# Altium schematic sheet PROC106B_AOP_IO.SchDoc: AOP_IO
size 431 x 279 mm; Date: Not shown in title block; ApprovedBy: Not shown in title block; CheckedBy: Not shown in title block; Author: Not shown in title block; CompanyName: Not shown in title block; DrawnBy: Antony/Anand Ram; Engineer: Not shown in title block; Organization: Not shown in title block; Address1: Not shown in title block; Address2: Not shown in title block; Address3: Not shown in title block; Address4: Not shown in title block; DocumentNumber: 3; Revision: Use project parameter SCH_Rev; SheetNumber: 3; SheetTotal: 12; PageSetup: Record=PageOptions|CenterHorizontal=True|CenterVertical=True|PrintScale=1.00|XCorrection=1.00|YCorrection=1.00|PrintKind=0|BorderSize=5000000|LeftOffset=0|BottomOffset=0|Orientation=2|PaperLength=1000|PaperWidth=1000|Scale=100|PaperSource=15|PrintQuality=600|MediaType=1|DitherType=10|PaperKind=Letter|PrintScaleMode=1; CurrentTime: Not shown in title block; CurrentDate: Not shown in title block; Time: Not shown in title block; DocumentFullPathAndName: Not shown in title block; DocumentName: Not shown in title block; ModifiedDate: Not shown in title block; ImagePath: Not shown in title block
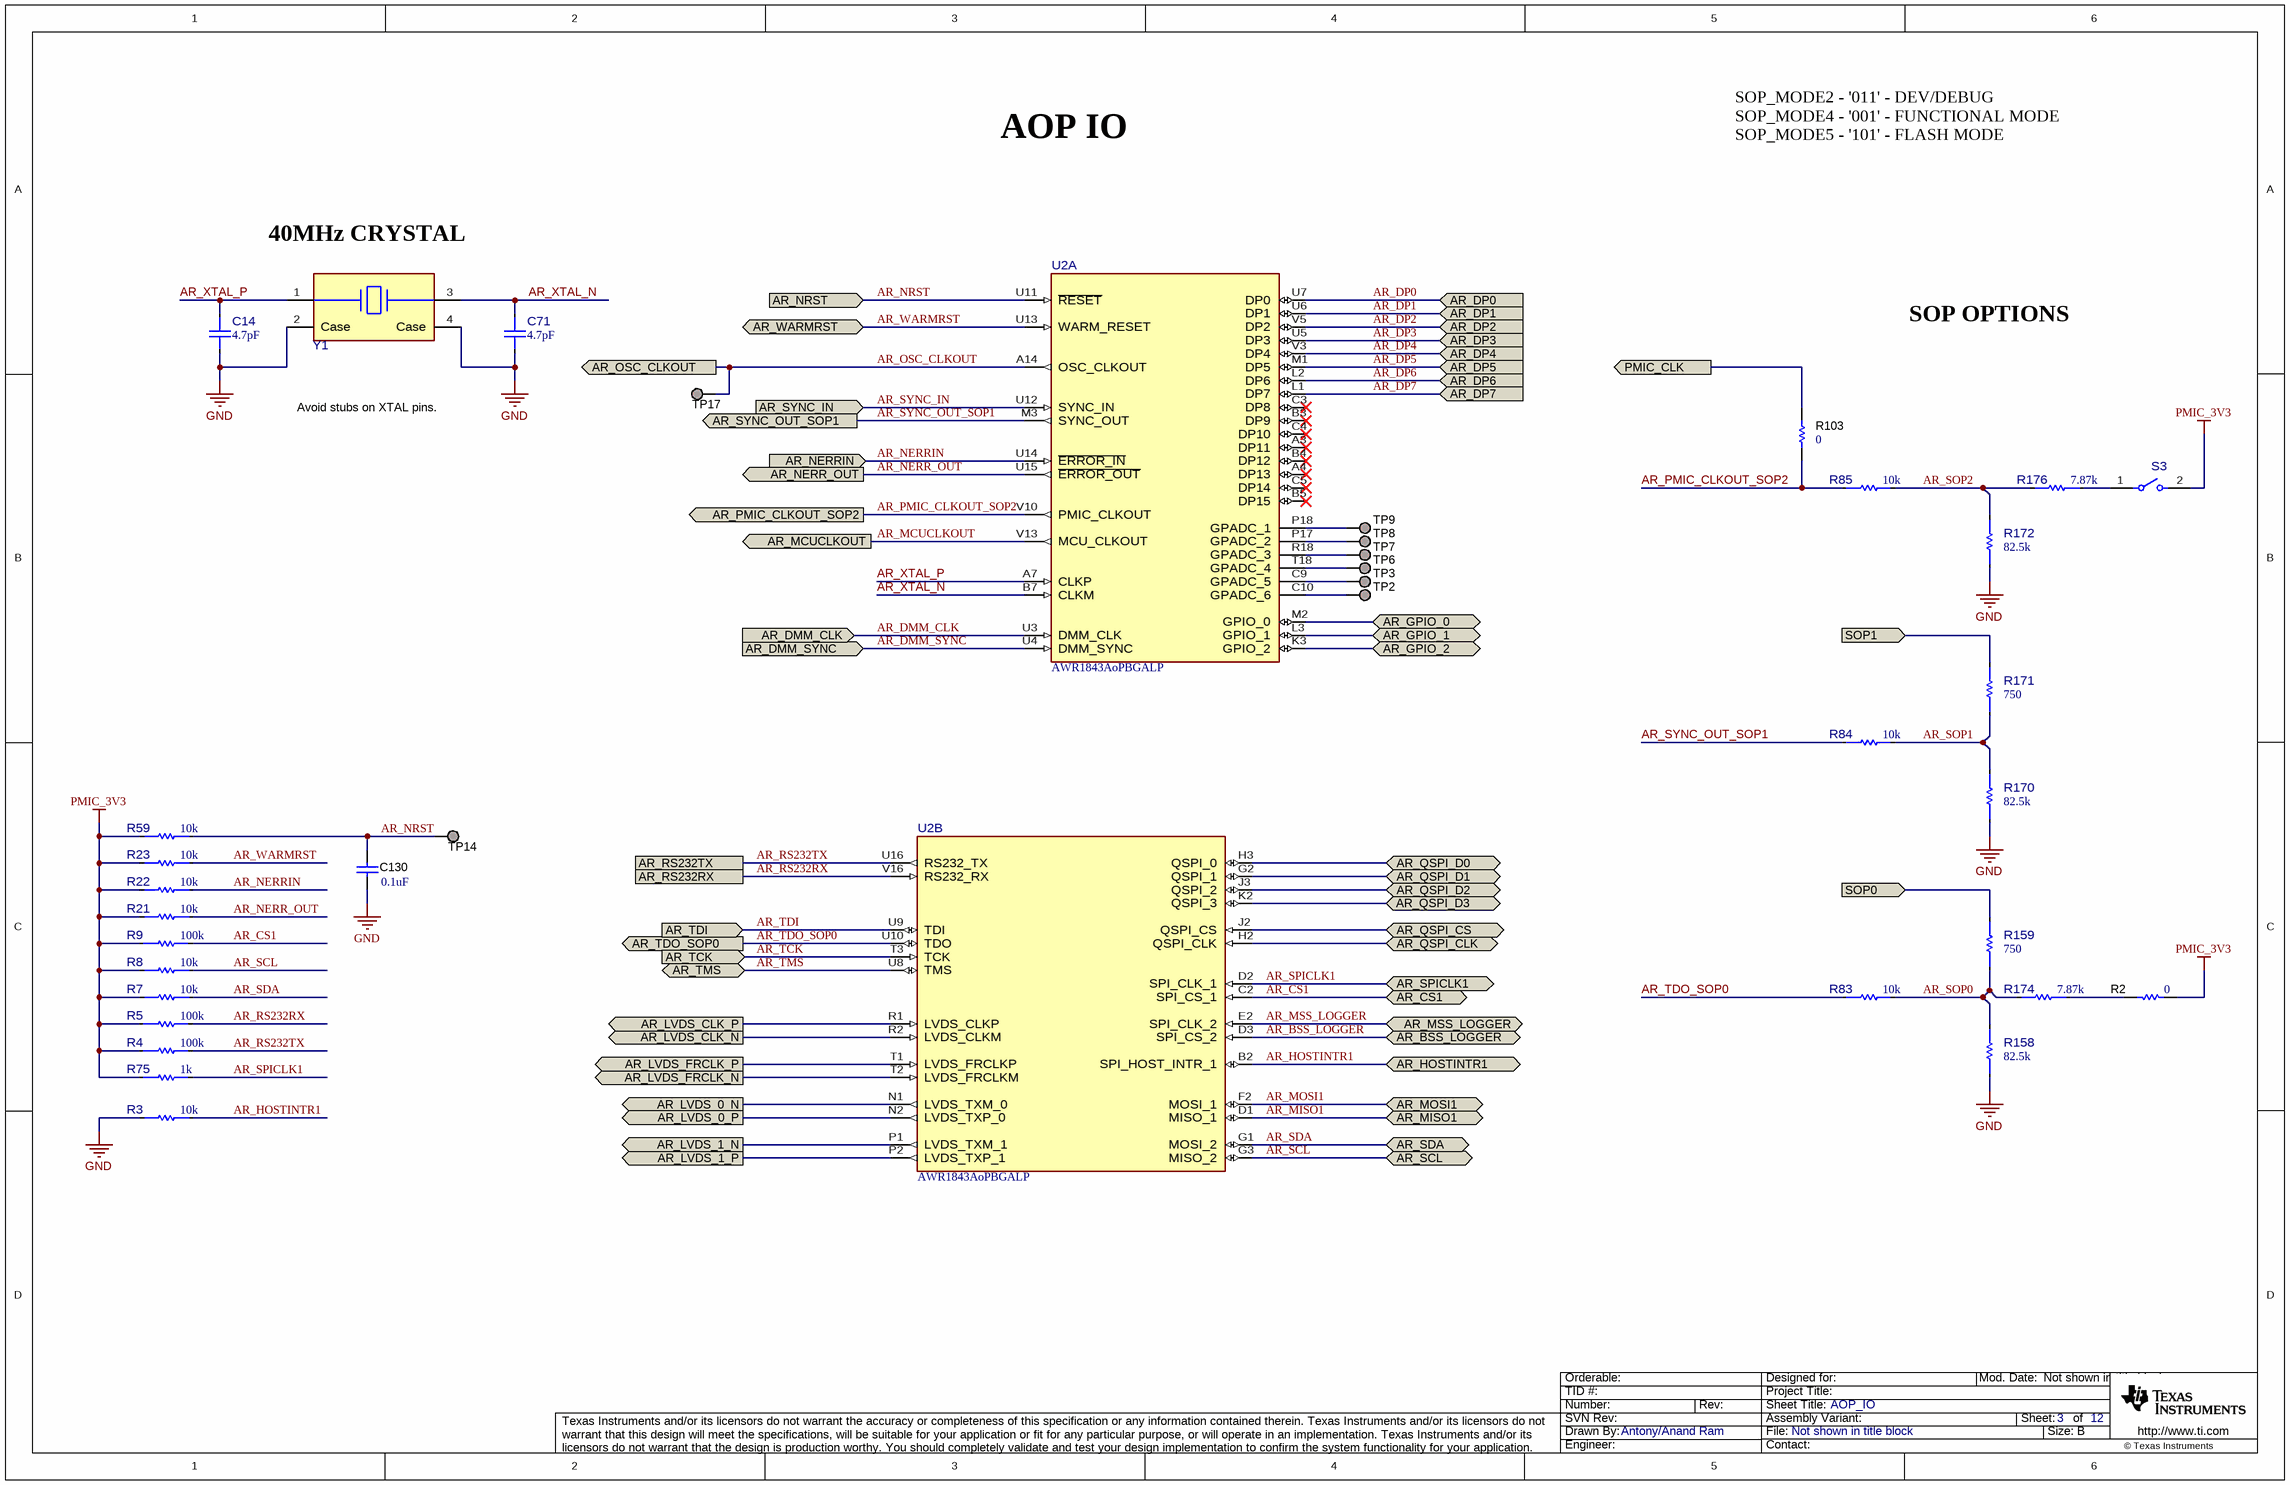
[diagram p0: PROC106B_AOP_IO.SchDoc]

## Parts
C14  ValueDisplayed: 4.7pF  [FP-CGA1A2C0G1H4R7C030BA_0201-IPC_C]  (hidden comment: CGA1A2C0G1H4R7C030BA)
C71  ValueDisplayed: 4.7pF  [FP-CGA1A2C0G1H4R7C030BA_0201-IPC_C]  (hidden comment: CGA1A2C0G1H4R7C030BA)
C130  ValueDisplayed: 0.1uF  [0402L]  (hidden comment: GCM155R71C104KA55D)
R2  ValueDisplayed: 0  [0201L]  (hidden comment: ERJ-1GN0R00C)
R3  value 10k  [FP-ERA-1AEB103C_0201-IPC_C]  (hidden comment: ERA-1AEB103C)
R4  value 100k  [FP-ERJ-1GNF1003C_0201-IPC_C]  (hidden comment: ERJ-1GNF1003C)
R5  value 100k  [FP-ERJ-1GNF1003C_0201-IPC_C]  (hidden comment: ERJ-1GNF1003C)
R7  value 10k  [FP-ERA-1AEB103C_0201-IPC_C]  (hidden comment: ERA-1AEB103C)
R8  value 10k  [FP-ERA-1AEB103C_0201-IPC_C]  (hidden comment: ERA-1AEB103C)
R9  value 100k  [FP-ERJ-1GNF1003C_0201-IPC_C]  (hidden comment: ERJ-1GNF1003C)
R21  value 10k  [FP-ERA-1AEB103C_0201-IPC_C]  (hidden comment: ERA-1AEB103C)
R22  value 10k  [FP-ERA-1AEB103C_0201-IPC_C]  (hidden comment: ERA-1AEB103C)
R23  value 10k  [FP-ERA-1AEB103C_0201-IPC_C]  (hidden comment: ERA-1AEB103C)
R59  value 10k  [FP-ERA-1AEB103C_0201-IPC_C]  (hidden comment: ERA-1AEB103C)
R75  value 1k  [FP-ERJ-1GNJ102C_0201-IPC_C]  (hidden comment: ERJ-1GNJ102C)
R83  value 10k  [FP-ERA-1AEB103C_0201-IPC_C]  (hidden comment: ERA-1AEB103C)
R84  value 10k  [FP-ERA-1AEB103C_0201-IPC_C]  (hidden comment: ERA-1AEB103C)
R85  value 10k  [FP-ERA-1AEB103C_0201-IPC_C]  (hidden comment: ERA-1AEB103C)
R103  ValueDisplayed: 0  [0201L]  (hidden comment: ERJ-1GN0R00C)
R158  value 82.5k  [FP-ERJ-1GNF8252C_0201-IPC_C]  (hidden comment: ERJ-1GNF8252C)
R159  value 750  [FP-ERJ-1GNJ751C_0201-IPC_C]  (hidden comment: ERJ-1GNJ751C)
R170  value 82.5k  [FP-ERJ-1GNF8252C_0201-IPC_C]  (hidden comment: ERJ-1GNF8252C)
R171  value 750  [FP-ERJ-1GNJ751C_0201-IPC_C]  (hidden comment: ERJ-1GNJ751C)
R172  value 82.5k  [FP-ERJ-1GNF8252C_0201-IPC_C]  (hidden comment: ERJ-1GNF8252C)
R174  value 7.87k  [FP-ERJ-1GNF7871C_0201-IPC_C]  (hidden comment: ERJ-1GNF7871C)
R176  value 7.87k  [FP-ERJ-1GNF7871C_0201-IPC_C]  (hidden comment: ERJ-1GNF7871C)
S3  CHS-01TA  [FP-CHS-01TA_SMT_SW_5MM4_2MM5-MFG]  (value not drawn)
TP2  TESTPOINT  [TP_25MIL-SMT]  (value not drawn)  (no BOM)
TP3  TESTPOINT  [TP_25MIL-SMT]  (value not drawn)  (no BOM)
TP6  TESTPOINT  [TP_25MIL-SMT]  (value not drawn)  (no BOM)
TP7  TESTPOINT  [TP_25MIL-SMT]  (value not drawn)  (no BOM)
TP8  TESTPOINT  [TP_25MIL-SMT]  (value not drawn)  (no BOM)
TP9  TESTPOINT  [TP_25MIL-SMT]  (value not drawn)  (no BOM)
TP14  TESTPOINT  [TP_25MIL-SMT]  (value not drawn)  (no BOM)
TP17  TESTPOINT  [TP_25MIL-SMT]  (value not drawn)  (no BOM)
U2  AWR1843AoPBGALP  [ALP0180A-MFG]  (parts A,B of 5)
Y1  FW4000044Q  [FP-FW4000044Q_4-SMD-2.0x1.6mm-MFG]  (value not drawn)

## Ports
AR_BSS_LOGGER (bidir), AR_CS1 (bidir), AR_DMM_CLK (in), AR_DMM_SYNC (in), AR_DP0 (in), AR_DP1 (in), AR_DP2 (in), AR_DP3 (in), AR_DP4 (in), AR_DP5 (in), AR_DP6 (in), AR_DP7 (in), AR_GPIO_0 (bidir), AR_GPIO_1 (bidir), AR_GPIO_2 (bidir), AR_HOSTINTR1 (bidir), AR_LVDS_0_N (out), AR_LVDS_0_P (out), AR_LVDS_1_N (out), AR_LVDS_1_P (out), AR_LVDS_CLK_N (out), AR_LVDS_CLK_P (out), AR_LVDS_FRCLK_N (out), AR_LVDS_FRCLK_P (out), AR_MCUCLKOUT (out), AR_MISO1 (bidir), AR_MOSI1 (bidir), AR_MSS_LOGGER (bidir), AR_NERR_OUT (out), AR_NERRIN (in), AR_NRST (in), AR_OSC_CLKOUT (out), AR_PMIC_CLKOUT_SOP2 (out), AR_QSPI_CLK (bidir), AR_QSPI_CS (bidir), AR_QSPI_D0 (bidir), AR_QSPI_D1 (bidir), AR_QSPI_D2 (bidir), AR_QSPI_D3 (bidir), AR_RS232RX, AR_RS232TX, AR_SCL (bidir), AR_SDA (bidir), AR_SPICLK1 (bidir), AR_SYNC_IN (in), AR_SYNC_OUT_SOP1 (out), AR_TCK (in), AR_TDI (in), AR_TDO_SOP0 (out), AR_TMS (bidir), AR_WARMRST (bidir), PMIC_CLK (out), SOP0 (in), SOP1 (in)

## Nets
GND: C14.2 C71.2 C130.1 R3.2 R158.1 R170.1 R172.1 Y1.2(Case) Y1.4(Case)
PMIC_3V3: R2.2 R4.1 R5.1 R7.2 R8.2 R9.1 R21.2 R22.2 R23.2 R59.2 R75.1 S3.2
AR_BSS_LOGGER: U2.D3(SPI_CS_2) ; port AR_BSS_LOGGER
AR_CS1: R9.2 U2.C2(SPI_CS_1) ; port AR_CS1
AR_DMM_CLK: U2.U3(DMM_CLK) ; port AR_DMM_CLK
AR_DMM_SYNC: U2.U4(DMM_SYNC) ; port AR_DMM_SYNC
AR_DP0: U2.U7(DP0) ; port AR_DP0
AR_DP1: U2.U6(DP1) ; port AR_DP1
AR_DP2: U2.V5(DP2) ; port AR_DP2
AR_DP3: U2.U5(DP3) ; port AR_DP3
AR_DP4: U2.V3(DP4) ; port AR_DP4
AR_DP5: U2.M1(DP5) ; port AR_DP5
AR_DP6: U2.L2(DP6) ; port AR_DP6
AR_DP7: U2.L1(DP7) ; port AR_DP7
AR_GPIO_0: U2.M2(GPIO_0) ; port AR_GPIO_0
AR_GPIO_1: U2.L3(GPIO_1) ; port AR_GPIO_1
AR_GPIO_2: U2.K3(GPIO_2) ; port AR_GPIO_2
AR_HOSTINTR1: R3.1 U2.B2(SPI_HOST_INTR_1) ; port AR_HOSTINTR1
AR_LVDS_0_N: U2.N1(LVDS_TXM_0) ; port AR_LVDS_0_N
AR_LVDS_0_P: U2.N2(LVDS_TXP_0) ; port AR_LVDS_0_P
AR_LVDS_1_N: U2.P1(LVDS_TXM_1) ; port AR_LVDS_1_N
AR_LVDS_1_P: U2.P2(LVDS_TXP_1) ; port AR_LVDS_1_P
AR_LVDS_CLK_N: U2.R2(LVDS_CLKM) ; port AR_LVDS_CLK_N
AR_LVDS_CLK_P: U2.R1(LVDS_CLKP) ; port AR_LVDS_CLK_P
AR_LVDS_FRCLK_N: U2.T2(LVDS_FRCLKM) ; port AR_LVDS_FRCLK_N
AR_LVDS_FRCLK_P: U2.T1(LVDS_FRCLKP) ; port AR_LVDS_FRCLK_P
AR_MCUCLKOUT: U2.V13(MCU_CLKOUT) ; port AR_MCUCLKOUT
AR_MISO1: U2.D1(MISO_1) ; port AR_MISO1
AR_MOSI1: U2.F2(MOSI_1) ; port AR_MOSI1
AR_MSS_LOGGER: U2.E2(SPI_CLK_2) ; port AR_MSS_LOGGER
AR_NERR_OUT: R21.1 U2.U15(~{ERROR_OUT}) ; port AR_NERR_OUT
AR_NERRIN: R22.1 U2.U14(~{ERROR_IN}) ; port AR_NERRIN
AR_NRST: C130.2 R59.1 TP14.1 U2.U11(~{RESET}) ; port AR_NRST
AR_OSC_CLKOUT: TP17.1 U2.A14(OSC_CLKOUT) ; port AR_OSC_CLKOUT
AR_PMIC_CLKOUT_SOP2: R85.1 R103.1 U2.V10(PMIC_CLKOUT) ; port AR_PMIC_CLKOUT_SOP2
AR_QSPI_CLK: U2.H2(QSPI_CLK) ; port AR_QSPI_CLK
AR_QSPI_CS: U2.J2(QSPI_CS) ; port AR_QSPI_CS
AR_QSPI_D0: U2.H3(QSPI_0) ; port AR_QSPI_D0
AR_QSPI_D1: U2.G2(QSPI_1) ; port AR_QSPI_D1
AR_QSPI_D2: U2.J3(QSPI_2) ; port AR_QSPI_D2
AR_QSPI_D3: U2.K2(QSPI_3) ; port AR_QSPI_D3
AR_RS232RX: R5.2 U2.V16(RS232_RX) ; port AR_RS232RX
AR_RS232TX: R4.2 U2.U16(RS232_TX) ; port AR_RS232TX
AR_SCL: R8.1 U2.G3(MISO_2) ; port AR_SCL
AR_SDA: R7.1 U2.G1(MOSI_2) ; port AR_SDA
AR_SOP0: R83.2 R158.2 R159.1 R174.2
AR_SOP1: R84.2 R170.2 R171.1
AR_SOP2: R85.2 R172.2 R176.2
AR_SPICLK1: R75.2 U2.D2(SPI_CLK_1) ; port AR_SPICLK1
AR_SYNC_IN: U2.U12(SYNC_IN) ; port AR_SYNC_IN
AR_SYNC_OUT_SOP1: R84.1 U2.M3(SYNC_OUT) ; port AR_SYNC_OUT_SOP1
AR_TCK: U2.T3(TCK) ; port AR_TCK
AR_TDI: U2.U9(TDI) ; port AR_TDI
AR_TDO_SOP0: R83.1 U2.U10(TDO) ; port AR_TDO_SOP0
AR_TMS: U2.U8(TMS) ; port AR_TMS
AR_WARMRST: R23.1 U2.U13(WARM_RESET) ; port AR_WARMRST
AR_XTAL_N: C71.1 U2.B7(CLKM) Y1.3(2_Xtal)
AR_XTAL_P: C14.1 U2.A7(CLKP) Y1.1(1_Xtal)
PMIC_CLK: R103.2 ; port PMIC_CLK
SOP0: R159.2 ; port SOP0
SOP1: R171.2 ; port SOP1
NetR2_1: R2.1 R174.1
NetR176_1: R176.1 S3.1
NetTP2_1: TP2.1 U2.C10(GPADC_6)
NetTP3_1: TP3.1 U2.C9(GPADC_5)
NetTP6_1: TP6.1 U2.T18(GPADC_4)
NetTP7_1: TP7.1 U2.R18(GPADC_3)
NetTP8_1: TP8.1 U2.P17(GPADC_2)
NetTP9_1: TP9.1 U2.P18(GPADC_1)

Not connected (* = marked no-connect by the designer): U2 A3(DP11)* A4(DP13)* B3(DP9)* B4(DP12)* B5(DP15)* C3(DP8)* C4(DP10)* C5(DP14)*

## Notes on the sheet
- AOP IO
- SOP_MODE2 - '011' - DEV/DEBUG
  SOP_MODE4 - '001' - FUNCTIONAL MODE
  SOP_MODE5 - '101' - FLASH MODE
- 40MHz CRYSTAL
- SOP OPTIONS
- Avoid stubs on XTAL pins.
- Drawn By:
- SVN Rev:
- Number:
- TID #:
- Orderable:
- Rev:
- Sheet Title:
- File:
- Project Title:
- Designed for:
- Assembly Variant:
- Mod. Date:
- Sheet:
- Size:
- of
- B
- http://www.ti.com
- Texas Instruments and/or its licensors do not warrant the accuracy or completeness of this specification or any information contained therein. Texas Instruments and/or its licensors do not warrant that this design will meet the specifications, will be suitable for your application or fit for any particular purpose, or will operate in an implementation. Texas Instruments and/or its licensors do not warrant that the design is production worthy. You should completely validate and test your design implementation to confirm the system functionality for your application.
- Engineer:
- Contact:
- © Texas Instruments

## Library data of the parts
C14 C71 = CMP-0090493-1: Cap Ceramic 4.7pF 50V C0G 0.25pF Pad SMD 0201 125°C Automotive T/R; Manufacturer: TDK; AEC Grade: Grade 1; AEC Qualified: Yes; SizeZ_mm: 0.4mm; TempCo: 30ppm/°C; RoHS: TRUE; Value: 4.7pF; Cap_F: 4.7pF; ComponentLink1Description: Datasheet; ComponentLink1URL: https://product.tdk.com/info/en/catalog/spec/mlccspec_automotive_general_en.pdf; PackageReference: 0201; PartNumber: CGA1A2C0G1H4R7C030BA; VDC_V: 50V; datasheet: https://product.tdk.com/info/en/catalog/spec/mlccspec_automotive_general_en.pdf; Datasheet Path: datasheets/Cap-CGA1A2C0G1H4R7C030BA.pdf; helpURL: https://upverter.com/upn/revision/6d92b1250c1f5160/; Lead Free: Yes; Operating Temperature Range: -55°C to +125°C; Part Number: CGA1A2C0G1H4R7C030BA; Temperature Characteristic: C0G
C130 = CMP-0006351-2: CAP, CERM, 0.1 uF, 16 V, +/- 10%, X7R, 0402; Manufacturer: MuRata; Cap_F: 100nF; SizeZ_mm: 0.6; VDC_V: 16V; AEC Category: Q200; Cap_Case: 0402; Polarized: N; SizeArea_mm2: 0.5; SizeAreaWB_mm2: 3; SizeX_mm: 1; TaMax_C: 125°C; TaMin_C: -55°C; U/M: EA; Value1: Unknown; Value: 0.1uF; RoHS: Y; AEC Qualified: ?; ComponentLink1Description: Datasheet link; ComponentLink1URL: http://psearch.murata.com/capacitor/product/GCM155R71C104KA55%23.pdf; PackageReference: 0402; PartNumber: GCM155R71C104KA55D; TempCo: X7R; Tolerance_%: 10%; CompType: Capacitor; MountType: SMT; SizeY_mm: 0.5; Supplier 1: Digi-Key; Supplier Part Number 1: 490-4759-2-ND; Technology: Ceramic; Value2: 16V; LatestRevisionDate: 2017-03-09; Published: 2008-06-19; Publisher: Texas Instruments
R2 R103 = CMP-0065361-1: RES, 0, 5%, .05 W, AEC-Q200 Grade 0, 0201; Manufacturer: Panasonic; AEC Qualified: Y; Power_W: 50mW; SizeZ_mm: 0.26; TempCo: ppm/C; AEC Category: Q200; EIA_Code: E24; Green_Lifecycle: Not Set; Green_REACh: Incomplete; SizeArea_mm2: 0.18; SizeX_mm: 0.6; SizeY_mm: 0.3; U/M: EA; Value2: .05W; Value: 0; Value_Code: 0000; RoHS: Y; ComponentLink1Description: Datasheet link; ComponentLink1URL: https://industrial.panasonic.com/cdbs/www-data/pdf/RDA0000/AOA0000C281.pdf; PackageReference: 0201; PartNumber: ERJ-1GN0R00C; Res_ohm: 0; Technology: Thick Film; Tolerance_%: 5%; AEC Grade: 0; CompType: Resistor; Green_EU RoHS-2: Incomplete; Green_EU RoHS: Incomplete; LatestRevisionDate: 2017-06-05; MountType: SMT; Published: 2016-10-14; Publisher: Texas Instruments; Supplier 1: Digi-Key; Supplier 2: Newark; Supplier 3: Mouser; Supplier Part Number 1: P15979CT-ND; Supplier Part Number 2: 51W5934; Supplier Part Number 3: 667-ERJ-1GN0R00C; Value1: 5%
R3 R7 R8 R21-R23 R59 R83-R85 = CMP-0090084-1: RES SMD 10K OHM 0.1% 1/20W 0201; Manufacturer: Panasonic; AEC Qualified: No; Power_W: 50mW; SizeZ_mm: 0.26mm; TempCo: 25ppm/°C; VDC_V: 25V; RoHS: TRUE; ComponentLink1Description: Datasheet; ComponentLink1URL: https://industrial.panasonic.com/cdbs/www-data/pdf/RDM0000/AOA0000C307.pdf; PackageReference: 0201; PartNumber: ERA-1AEB103C; Res_ohm: 10k; Technology: Thin Film; Tolerance_%: 0.1%; datasheet: https://industrial.panasonic.com/cdbs/www-data/pdf/RDM0000/AOA0000C307.pdf; Datasheet Path: datasheets/Res-ERA-1AEB103C.pdf; Digikey Description: RES SMD 10K OHM 0.1% 1/20W 0201; Digikey Part Number: P10KBXCT-ND; helpURL: https://upverter.com/upn/revision/ad75fa42d92ba837/; Lead Free: Yes; Mouser Part Number: 667-ERA-1AEB103C; Operating Temperature Range: -55°C to +155°C; Part Number: ERA-1AEB103C; Series: ERA; Supplier 1: Digikey; Supplier 2: Mouser; Supplier Part Number 1: P10KBXCT-ND; Supplier Part Number 2: 667-ERA-1AEB103C
R4 R5 R9 = CMP-0090298-1: 100 kOhms ±1% 0.05W, 1/20W Chip Resistor 0201 (0603 Metric) Automotive AEC-Q200 Thick Film; Manufacturer: Panasonic Electronic Components; AEC Grade: Grade 1; AEC Qualified: Yes; Power_W: 50mW; SizeZ_mm: 0.26mm; TempCo: 200ppm/°C; VDC_V: 25V; RoHS: TRUE; ComponentLink1Description: Datasheet; ComponentLink1URL: https://industrial.panasonic.com/cdbs/www-data/pdf/RDA0000/AOA0000C304.pdf; PackageReference: 0201; PartNumber: ERJ-1GNF1003C; Res_ohm: 100k; Supplier 1: Digikey; Supplier 2: Mouser; Supplier Part Number 1: P122655CT-ND; Supplier Part Number 2: 667-ERJ-1GNF1003C; Technology: Thick Film; Tolerance_%: 1%; datasheet: https://industrial.panasonic.com/cdbs/www-data/pdf/RDA0000/AOA0000C304.pdf; Datasheet Path: datasheets/Res-ERJ-1GNF1003C.pdf; Digikey Description: RES SMD 100K OHM 1% 1/20W 0201; Digikey Part Number: P122655CT-ND; helpURL: https://upverter.com/upn/revision/52b354a5d57be433/; Lead Free: Yes; Mouser Description: Thick Film Resistors 0201 100Kohm 1% HalogenFree AEC-Q200; Mouser Part Number: 667-ERJ-1GNF1003C; Operating Temperature Range: -55°C to +125°C; Part Number: ERJ-1GNF1003C; Series: ERJ
R75 = CMP-0090500-1: 1 kOhms ±5% 0.05W, 1/20W Chip Resistor 0201 (0603 Metric) Automotive AEC-Q200 Thick Film; Manufacturer: Panasonic Electronic Components; AEC Grade: Grade 1; AEC Qualified: Yes; Power_W: 50mW; SizeZ_mm: 0.26mm; TempCo: 200ppm/°C; VDC_V: 25V; RoHS: TRUE; ComponentLink1Description: Datasheet; ComponentLink1URL: http://industrial.panasonic.com/www-cgi/jvcr13pz.cgi?E+PZ+3+AOA0002+ERJ1GNJ102C+7+WW; PackageReference: 0201; PartNumber: ERJ-1GNJ102C; Res_ohm: 1k; Supplier 1: Digikey; Supplier 2: Mouser; Supplier Part Number 1: P123221CT-ND; Supplier Part Number 2: 667-ERJ-1GNJ102C; Technology: Thick Film; Tolerance_%: 5%; datasheet: http://industrial.panasonic.com/www-cgi/jvcr13pz.cgi?E+PZ+3+AOA0002+ERJ1GNJ102C+7+WW; Datasheet Path: datasheets/Res-ERJ-1GNJ102C.pdf; Digikey Description: RES SMD 1K OHM 5% 1/20W 0201; Digikey Part Number: P123221CT-ND; helpURL: https://upverter.com/upn/revision/53a311929d77a537/; Lead Free: Yes; Mouser Description: Thick Film Resistors - SMD 0201 1Kohm 5% HalogenFree AEC-Q200; Mouser Part Number: 667-ERJ-1GNJ102C; Operating Temperature Range: -55°C to +125°C; Part Number: ERJ-1GNJ102C; Series: ERJ
R158 R170 R172 = CMP-0090499-1: Res Thick Film 0201 82.5K Ohm 1% 1/20W ±200ppm/°C Molded SMD SMD T/R; Manufacturer: Panasonic; AEC Grade: Grade 1; AEC Qualified: Yes; Power_W: 50mW; SizeZ_mm: 0.26mm; VDC_V: 25V; RoHS: TRUE; ComponentLink1Description: Datasheet; ComponentLink1URL: https://industrial.panasonic.com/cdbs/www-data/pdf/RDA0000/AOA0000C304.pdf; PackageReference: 0201; PartNumber: ERJ-1GNF8252C; Res_ohm: 82.5k; Supplier 1: Digikey; Supplier 2: Mouser; Supplier Part Number 1: P123175CT-ND; Supplier Part Number 2: 667-ERJ-1GNF8252C; Technology: Thick Film; TempCo: 200ppm/°C; Tolerance_%: 1%; datasheet: https://industrial.panasonic.com/cdbs/www-data/pdf/RDA0000/AOA0000C304.pdf; Datasheet Path: datasheets/Res-ERJ-1GNF8252C.pdf; Digikey Description: RES SMD 82.5K OHM 1% 1/20W 0201; Digikey Part Number: P123175CT-ND; helpURL: https://upverter.com/upn/revision/4f118edabd8df0f2/; Lead Free: Yes; Mouser Description: Res Thick Film 0201 82.5K Ohm 1% 1/20W ±200ppm/°C Molded SMD SMD T/R; Mouser Part Number: 667-ERJ-1GNF8252C; Operating Temperature Range: -55°C to +125°C; Part Number: ERJ-1GNF8252C; Series: ERJ
R159 R171 = CMP-0090503-1: Res Thick Film 0201 750 Ohm 5% 0.05W(1/20W) ±200ppm/C Pad SMD Automotive T/R; Manufacturer: Panasonic Electronic Components; AEC Grade: Grade 1; AEC Qualified: Yes; Power_W: 50mW; SizeZ_mm: 0.26mm; TempCo: 200ppm/°C; VDC_V: 25V; RoHS: TRUE; ComponentLink1Description: Datasheet; ComponentLink1URL: https://industrial.panasonic.com/cdbs/www-data/pdf/RDA0000/AOA0000C301.pdf; PackageReference: 0201; PartNumber: ERJ-1GNJ751C; Res_ohm: 750; Supplier 1: Digikey; Supplier 2: Mouser; Supplier Part Number 1: P123367CT-ND; Supplier Part Number 2: 667-ERJ-1GNJ751C; Technology: Thick Film; Tolerance_%: 5%; datasheet: https://industrial.panasonic.com/cdbs/www-data/pdf/RDA0000/AOA0000C301.pdf; Datasheet Path: datasheets/Res-ERJ-1GNJ751C.pdf; Digikey Description: RES SMD 750 OHM 5% 1/20W 0201; Digikey Part Number: P123367CT-ND; helpURL: https://upverter.com/upn/revision/8f71e8ce5b6d0ac2/; Lead Free: Yes; Mouser Description: Thick Film Resistors - SMD 0201 750ohm 5% HalogenFree AEC-Q200; Mouser Part Number: 667-ERJ-1GNJ751C; Operating Temperature Range: -55°C to +125°C; Part Number: ERJ-1GNJ751C; Series: ERJ
R174 R176 = CMP-0090498-1: Res Thick Film 0201 7.87K Ohm 1% 1/20W ±200ppm/°C Molded SMD SMD T/R; Manufacturer: Panasonic; AEC Grade: Grade 1; AEC Qualified: Yes; Power_W: 50mW; SizeZ_mm: 0.26mm; VDC_V: 25V; RoHS: TRUE; ComponentLink1Description: Datasheet; ComponentLink1URL: https://industrial.panasonic.com/cdbs/www-data/pdf/RDA0000/AOA0000C304.pdf; PackageReference: 0201; PartNumber: ERJ-1GNF7871C; Res_ohm: 7.87k; Supplier 1: Digikey; Supplier 2: Mouser; Supplier Part Number 1: P123160CT-ND; Supplier Part Number 2: 667-ERJ-1GNF7871C; Technology: Thick Film; TempCo: 200ppm/°C; Tolerance_%: 1%; datasheet: https://industrial.panasonic.com/cdbs/www-data/pdf/RDA0000/AOA0000C304.pdf; Datasheet Path: datasheets/Res-ERJ-1GNF7871C.pdf; Digikey Description: RES SMD 7.87K OHM 1% 1/20W 0201; Digikey Part Number: P123160CT-ND; helpURL: https://upverter.com/upn/revision/e5a66236bcc50cef/; Lead Free: Yes; Mouser Description: Thick Film Resistors - SMD 0201 7.87Kohm 1% HalogenFree AEC-Q200; Mouser Part Number: 667-ERJ-1GNF7871C; Operating Temperature Range: -55°C to +125°C; Part Number: ERJ-1GNF7871C; Series: ERJ
S3 = CMP-0087181-1: SWITCH SLIDE DIP SPST 100MA 6V; Manufacturer: Nidec Copal Electronics; PositionCount: 1; SizeZ_mm: 2.5mm; Symbol Name: SYM-CHS-01TA; RoHS: TRUE; Circuit: SPST; ComponentLink1Description: Datasheet; ComponentLink1URL: https://www.nidec-copal-electronics.com/e/catalog/switch/chs.pdf; MountType: Surface Mount; PackageReference: SMT_SW_5MM4_2MM5; PartNumber: CHS-01TA; VDC_V: 6V
TP2 TP3 TP6-TP9 TP14 TP17 = CMP-0078143-3: TEST POINT.  No entry in BOM.; CompType: Testpoint; Manufacturer: N/A; PackageReference: N/A; PartNumber: N/A; Library Reference: TESTPOINT
U2 = CMP-0090288-2: Manufacturer: Texas Instruments; Standoff Height: 0.31mm; SizeZ_mm: 0.965mm; AEC Category: Q200; CompType: IC; PackageReference: FCBGA180; helpURL: https://upverter.com/upn/revision/1d9228af6d9453a7/; RoHS: UNKNOWN; Datasheet Path: datasheets/IC-AWR1843AoPBGALP.pdf; Operating Temperature Range: to; PartNumber: AWR1843AoPBGALP; Part Number: AWR1843AoPBGALP; ComponentLink2URL: http://www.ti.com/product/GPN; ComponentLink3URL: http://www.ti.com/product/GPN/datasheet; ComponentLink1URL: http://www.ti.com/lit/ds/symlink/GPN.pdf; ComponentLink3Description: Online Datasheet; ComponentLink2Description: Product Folder; ComponentLink1Description: Datasheet Link
Y1 = CMP-0090505-1: 40MHz ±10ppm Crystal 8pF 50 Ohms 4-SMD, No Lead; Manufacturer: Diodes; AEC Qualified: Yes; Frequency Stability: 50ppm; SizeZ_mm: 0.55mm; AEC Grade: Grade 1; Esr: 50; RoHS: TRUE; ComponentLink1Description: Datasheet; ComponentLink1URL: https://www.diodes.com/assets/Datasheets/FW.pdf; Frequency_Fixed: 40MHz; Frequency Tolerance: 10ppm; Load Capacitance: 8pF; PackageReference: 4-SMD-2.0x1.6mm; PartNumber: FW4000044Q; datasheet: https://www.diodes.com/assets/Datasheets/FW.pdf; Datasheet Path: datasheets/Crys-FW4000044Q.pdf; Digikey Description: CRYSTAL CERAMIC SEAM2016R 3K; Digikey Part Number: FW4000044QDICT-ND; helpURL: https://upverter.com/upn/revision/d451487a111b898c/; Lead Free: Yes; Mouser Part Number: 729-FW4000044Q; Operating Temperature Range: -40°C to +125°C; Part Number: FW4000044Q; Series: FW; Supplier 1: Digikey; Supplier 2: Mouser; Supplier Part Number 1: FW4000044QDICT-ND; Supplier Part Number 2: 729-FW4000044Q; Tolerance_%: 10ppm